# EAGLE design ADC_Clock_board (EAGLE 5.11)
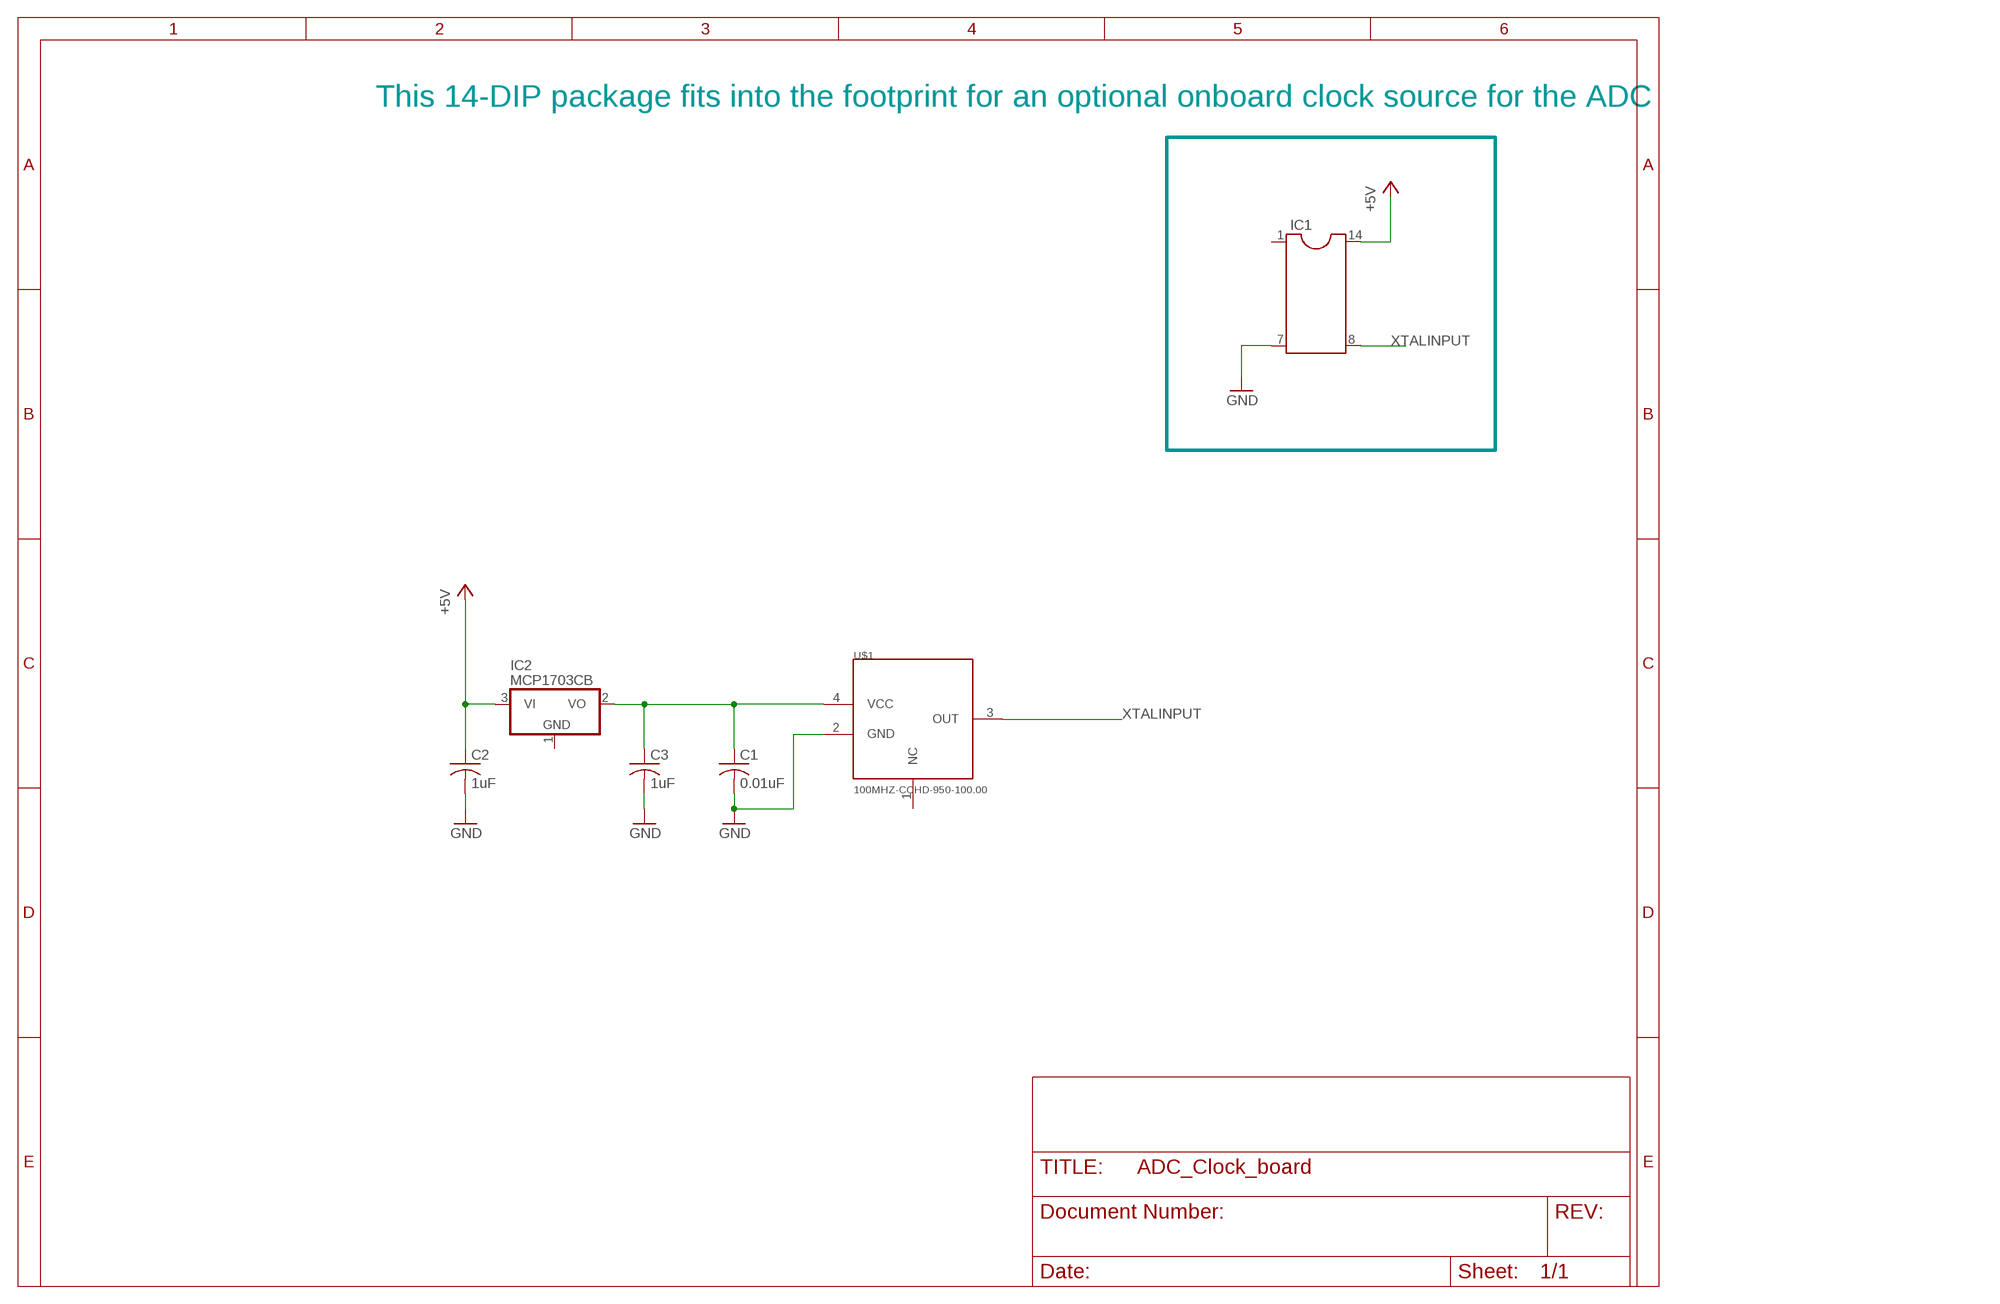
[diagram p0: schematic, sheet 1]

## Parts
C1  0.01uF  C-USC0603  [C0603]
C2  1uF  C-USC0603  [C0603]
C3  1uF  C-USC0603  [C0603]
IC1  DIL14/4  [DIL14/4]
IC2  MCP1703CB  [SOT23]
U$1  100MHZ-CCHD-950-100.00  [4-7MX5M]

## Nets
+5V: C2.1 IC1.14 IC2.3(VI)
GND: C1.2 C2.2 C3.2 IC1.7 U$1.2(GND)
N$1: C1.1 C3.1 IC2.2(VO) U$1.4(VCC)
XTALINPUT: IC1.8 U$1.3(OUT)
Unconnected: IC1.1 IC2.1(GND) U$1.1(NC)

## Notes on the sheet
- This 14-DIP package fits into the footprint for an optional onboard clock source for the ADC

## Library data of the parts
C1-C3 = rcl:C-US: CAPACITOR, American symbol
IC1 = ic-package:DIL14/4: Dual In Line / Socket
IC2 = linear:MCP1703: 250 mA, 16V, Low Quiescent Current LDO Regulator Source: http://ww1.microchip.com/downloads/en/DeviceDoc/22049b.pdf
U$1 = untitled:100MHZ-CCHD-950-100.00

## Board
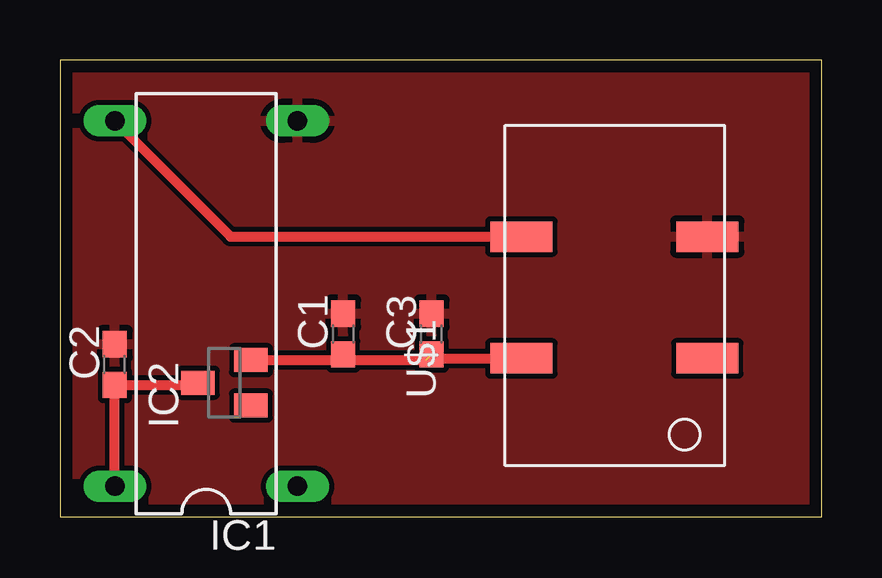
[diagram p1: board, top side]
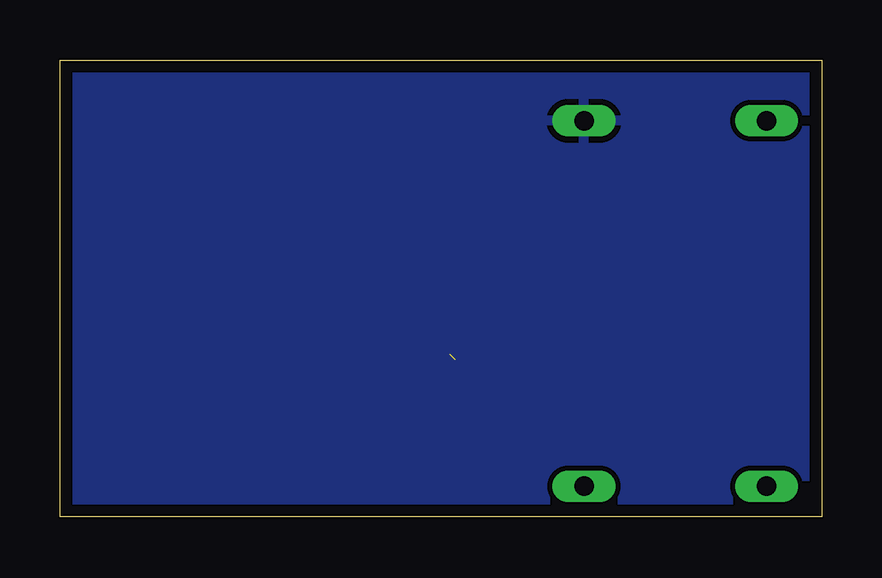
[diagram p2: board, bottom side, seen from below]

Size 31.75 x 19.05 mm. Coordinates in mm from the lower left corner, seen from the top.
Outline: 0,0 31.75,0 31.75,19.05 0,19.05 0,0
Copper layers (1*16): Top 0.035mm / dielectric 1.5mm / Bottom 0.035mm
Design rules "std design rules": minimum track width 8mil, minimum drill 18mil, track to track 8mil, track to pad 12mil, pad to pad 12mil, via to via 8mil, smd to smd 8mil, copper to edge 20mil, drill to drill 8mil, minimum pad ring 10mil, minimum via ring 8mil, stop-mask expansion 0mil, vias tented up to drill 0mil, thermal gap 10mil

### Footprints (pad centres in the part's own frame; a part is rotated, then mirrored left to right if it is on the bottom)
C0603 = smd 1.1 x 1: 1 -0.85,0; 2 0.85,0
DIL14/4 = drill 0.813 long: 1 -7.62,-3.81; 7 7.62,-3.81; 8 7.62,3.81; 14 -7.62,3.81
SOT23 = smd 1 x 1.4: 1 -0.95,-1.1; 2 0.95,-1.1; 3 0,1.1
4-7MX5M = smd 1.27 x 2.6: 1 0,-0.32; 2 5.08,-0.32; 3 5.08,7.43; 4 0,7.43

### Placement (x,y rotation side)
C1  11.81,7.62 90 top
C2  2.29,6.35 90 top
C3  15.49,7.62 90 top
IC1  6.1,8.89 90 top
IC2  6.86,5.59 90 top
U$1  26.67,6.6 90 top

### Tracks (layer width: path | path; a pad name or v marks a point on that pad's centre or on a via)
+5V
  Top 0.406: IC1.14 C2.1 5.76,5.5 IC2.3
GND
  pour Top: 31.75,19.05 31.75,0 0,0 0,19.05
  pour Bottom: 0.25,19.05 31.75,19.05 31.75,0 0,0 0,19.05
N$1  (1 unrouted)
  Top 0.406: 15.26,6.54 11.81,6.54 C1.1 11.58,6.54 IC2.2 | U$1.4 15.66,6.6 C3.1
XTALINPUT
  Top 0.406: U$1.3 7.11,11.68 IC1.8